# EAGLE design Qwiic_BMP388_Pressure_Sensor (EAGLE 9.6.2)
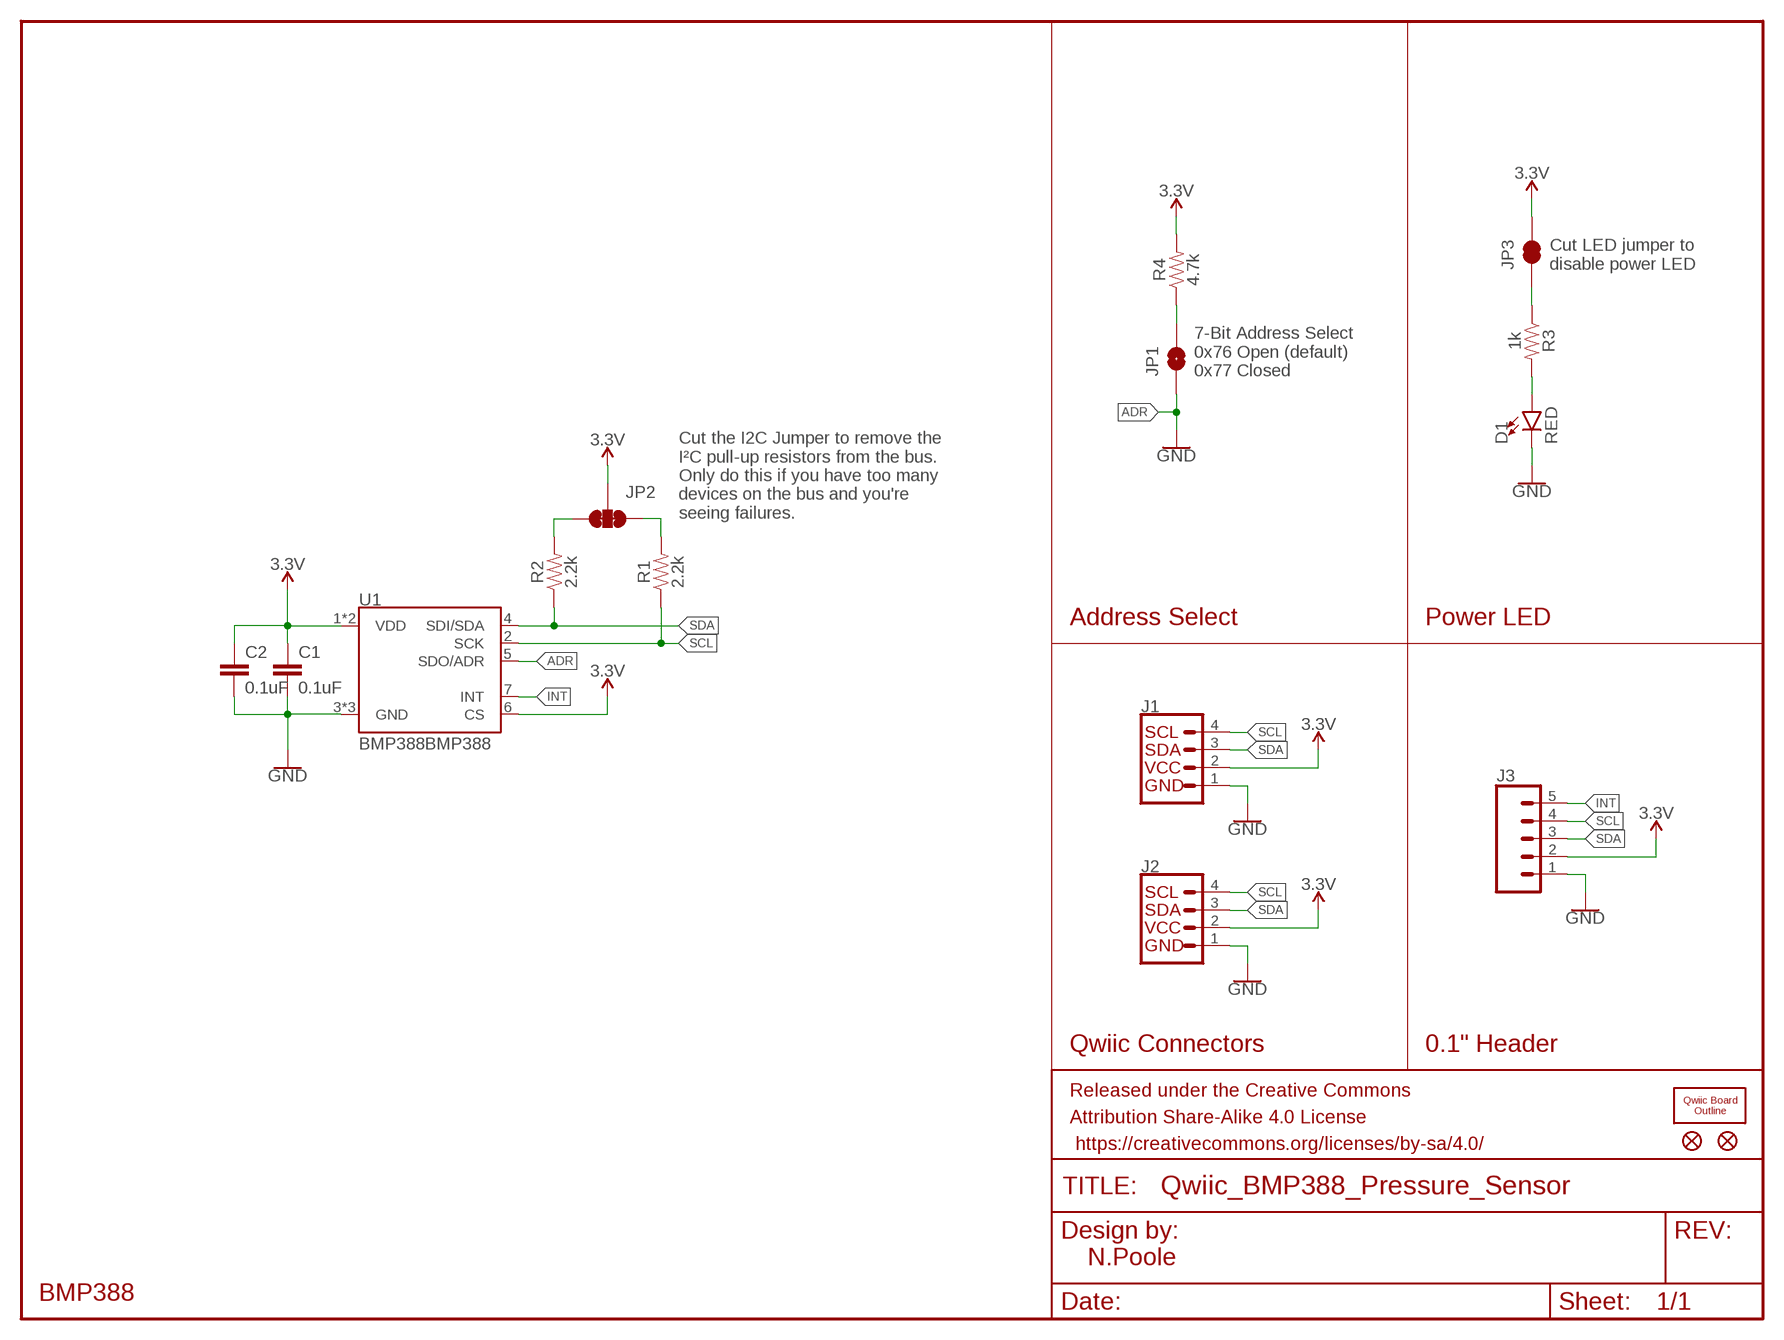
[diagram p0: schematic, sheet 1]

## Parts
A1  QWIIC_BOARD_OUTLINEH  [QWIIC_BOARD_MOUNT_HOLES]
C1  0.1uF  0.1UF-0603-25V-(+80/-20%)  [0603]
C2  0.1uF  0.1UF-0603-25V-(+80/-20%)  [0603]
D1  RED  LED-RED0603  [LED-0603]
FD1  FIDUCIALUFIDUCIAL  [FIDUCIAL-MICRO]
FD2  FIDUCIALUFIDUCIAL  [FIDUCIAL-MICRO]
FRAME1  FRAME-LETTERNO_PACKAGE  [DUMMY]
J1  QWIIC_CONNECTORJS-1MM  [1X04_1MM_RA]
J2  QWIIC_CONNECTORJS-1MM  [1X04_1MM_RA]
J3  CONN_05NO_SILK  [1X05_NO_SILK]
JP1  JUMPER-SMT_2_NO_SILK  [SMT-JUMPER_2_NO_SILK]
JP2  JUMPER-SMT_3_2-NC_TRACE_SILK  [SMT-JUMPER_3_2-NC_TRACE_SILK]
JP3  JUMPER-SMT_2_NC_TRACE_SILK  [SMT-JUMPER_2_NC_TRACE_SILK]
R1  2.2k  2.2KOHM-0603-1/10W-1%  [0603]
R2  2.2k  2.2KOHM-0603-1/10W-1%  [0603]
R3  1k  1KOHM-0603-1/10W-1%  [0603]
R4  4.7k  4.7KOHM-0603-1/10W-1%  [0603]
U1  BMP388BMP388  [LGA-10(2X2)]

## Nets
3.3V: C1.1 C2.1 J1.2(VCC) J2.2(VCC) J3.2 JP2.2 JP3.2 R4.2 U1.1(VDD) U1.6(CS) U1.10(VDD)
ADR: JP1.1 U1.5(SDO/ADR) ; supply symbol labelled GND
GND: C1.2 C2.2 D1.C J1.1(GND) J2.1(GND) J3.1 U1.3(GND) U1.8(GND) U1.9(GND)
INT: J3.5 U1.7(INT)
N$1: JP2.3 R2.2
N$2: JP2.1 R1.2
N$3: JP1.2 R4.1
N$4: JP3.1 R3.1
N$5: D1.A R3.2
SCL: J1.4(SCL) J2.4(SCL) J3.4 R1.1 U1.2(SCK)
SDA: J1.3(SDA) J2.3(SDA) J3.3 R2.1 U1.4(SDI/SDA)

## Notes on the sheet
- Cut LED jumper to 
  disable power LED
- 7-Bit Address Select
  0x76 Open (default)
  0x77 Closed
- Cut the I2C Jumper to remove the 
  I²C pull-up resistors from the bus. 
  Only do this if you have too many
  devices on the bus and you're 
  seeing failures.
- Address Select | Power LED
- Qwiic Connectors | 0.1" Header
- N.Poole
- BMP388

## Library data of the parts
A1 = SparkX:QWIIC_BOARD_OUTLINE: Standard Outline of a Qwiic Board. Good for defining a spot on shields and board areas in which to mount a Qwiic Board.
C1 C2 = SparkFun-Capacitors:0.1UF: 0.1µF ceramic capacitors A capacitor is a passive two-terminal electrical component used to store electrical energy temporarily in an electric field.; PROD_ID: CAP-00810
D1 = SparkFun-LED:LED-RED: Red SMD LED Used in manufacturing of most products at SparkFun Packages: 0603 - SMD 0603 package [Product Link] <http://docs.avagotech.com/docs/AV02-0551EN> 0603 SMART - SMD 0603 SMART package ( more efficient and expensive)[Product Link] <http://www.osram-os.com/Graphics/XPic2/00077099_0.pdf> 1206 - SMD1206 package [Product Link] <https://www.sparkfun.com/datasheets/DevTools/LilyPad/Q150OVS4.pdff> SparkFun Products: Pro Mini 328 -5V <https://www.sparkfun.com/products/821> RedBoard <https://www.sparkfun.com/products/12757> IOIO-OTG <https://www.sparkfun.com/products/13613>; PROD_ID: DIO-00819
FD1 FD2 = SparkFun-Aesthetics:FIDUCIAL: Fiducial Alignment Points Point-of-reference for pick-and-place machines and other optical instruments.
FRAME1 = SparkFun-Aesthetics:FRAME-LETTER: Schematic Frame - Letter Standard 8.5x11 US Letter frame; DESIGNER: Nobody; VERSION: v01
J1 J2 = SparkFun-Connectors:QWIIC_CONNECTOR: SparkFun I2C Standard Qwiic Connector An SMD 1mm pitch JST connector makes it easy and quick (get it? Qwiic?) to connect I2C devices to each other. The Qwiic system <http://www.sparkfun.com/qwiic> enables fast and solderless connection between popular platforms and various sensors and actuators. We carry 200mm <https://www.sparkfun.com/products/14204>, 100mm <https://www.sparkfun.com/products/14205>, 50mm <https://www.sparkfun.com/products/14206>, and breadboard friendly <https://www.sparkfun.com/products/14207> Qwiic cables. We also offer 10 pcs strips <https://www.sparkfun.com/products/14323> the SMD connectors.
J3 = SparkFun-Connectors:CONN_05: Multi connection point. Often used as Generic Header-pin footprint for 0.1 inch spaced/style header connections On any of the 0.1 inch spaced packages, you can populate with these: Break Away Headers - Straight <https://www.sparkfun.com/products/116> (PRT-00116) Break Away Male Headers - Right Angle <https://www.sparkfun.com/products/553> (PRT-00553) Female Headers <https://www.sparkfun.com/products/115> (PRT-00115) Break Away Headers - Machine Pin <https://www.sparkfun.com/products/117> (PRT-00117) Break Away Female Headers - Swiss Machine Pin <https://www.sparkfun.com/products/743> (PRT-00743) For SCREWTERMINALS and SPRING TERMINALS visit here: Screw Terimnals on SparkFun.com <https://www.sparkfun.com/search/results?term=Screw+Terminals> (5mm/3.5mm/2.54mm spacing) This device is also useful as a general connection point to wire up your design to another part of your project. Our various solder wires solder well into these plated through hole pads. Hook-Up Wire - Assortment (Stranded, 22 AWG) <https://www.sparkfun.com/products/11375> (PRT-11375) Hook-Up Wire - Assortment (Solid Core, 22 AWG) <https://www.sparkfun.com/products/11367> (PRT-11367) View the entire wire category on our website here <https://www.sparkfun.com/categories/141> Special notes: Molex polarized connector foot print use with SKU : PRT-08231 with associated crimp pins and housings. 1MM SMD Version SKU: PRT-10208
JP1 = SparkFun-Jumpers:JUMPER-SMT_2_NO: Normally open jumper This jumper has two pads in close proximity to each other. Apply solder to close the connection. Round pads are easier to solder for beginners, but are a lot larger. SparkFun Product that uses the round pads: SparkFun EL Sequencer <https://www.sparkfun.com/products/12781>
JP2 = SparkFun-Jumpers:JUMPER-SMT_3_2-NC_TRACE: Normally closed trace jumper (2 of 2 connections) This jumper has a trace between all three pads so they are normally closed (NC). Use a razor knife to open the connection(s). For best results follow the IPC guidelines for cutting traces: Cutout at least 0.063 mm (0.005 in). Remove all loose material to clean up the cut area. Seal the cut with an approved epoxy. Reapply solder to reclose the connection(s).
JP3 = SparkFun-Jumpers:JUMPER-SMT_2_NC_TRACE: Normally closed trace jumper This jumper has a trace between two pads so it's normally closed (NC). Use a razor knife to open the connection. For best results follow the IPC guidelines for cutting traces: Cutout at least 0.063 mm (0.005 in). Remove all loose material to clean up the cut area. Seal the cut with an approved epoxy. Reapply solder to reclose the connection.
R1 R2 = SparkFun-Resistors:2.2KOHM: 2.2kΩ resistor A resistor is a passive two-terminal electrical component that implements electrical resistance as a circuit element. Resistors act to reduce current flow, and, at the same time, act to lower voltage levels within circuits. - Wikipedia; PROD_ID: RES-08272
R3 = SparkFun-Resistors:1KOHM: 1kΩ resistor A resistor is a passive two-terminal electrical component that implements electrical resistance as a circuit element. Resistors act to reduce current flow, and, at the same time, act to lower voltage levels within circuits. - Wikipedia; PROD_ID: RES-07856
R4 = SparkFun-Resistors:4.7KOHM: 4.7kΩ resistor A resistor is a passive two-terminal electrical component that implements electrical resistance as a circuit element. Resistors act to reduce current flow, and, at the same time, act to lower voltage levels within circuits. - Wikipedia; PROD_ID: RES-07857
U1 = SparkFun-Sensors:BMP388: Bosch BMP3388 Pressure Sensor Senses pressure from 300 hPa to 1250 hPa, sends data out over I2C or Serial; PROD_ID: IC-14045

## Board
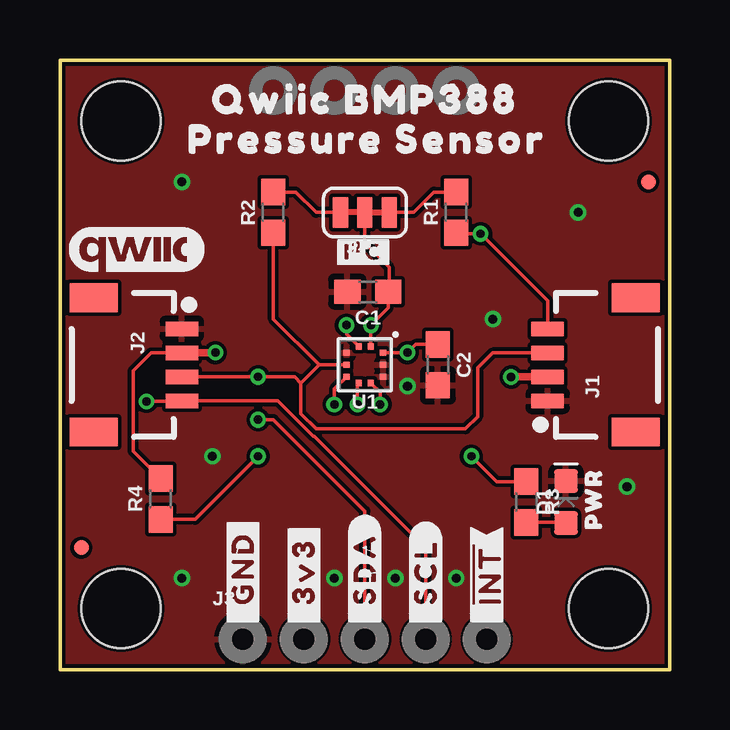
[diagram p1: board, top side]
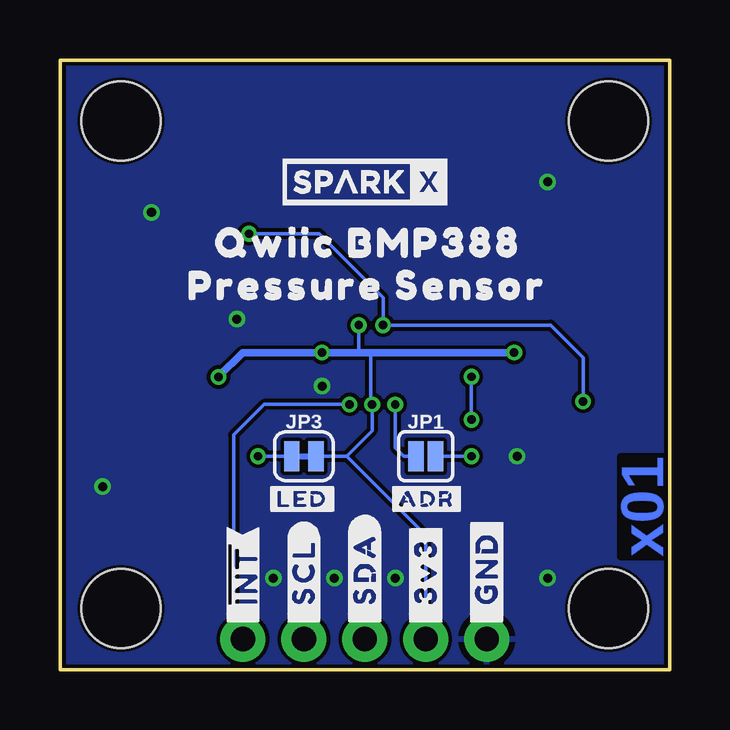
[diagram p2: board, bottom side, seen from below]

Size 25.4 x 25.4 mm. Coordinates in mm from the lower left corner, seen from the top.
Outline: 0,25.4 25.4,25.4 25.4,0 0,0 0,25.4
Copper layers (1*16): Top 0.035mm / dielectric 1.5mm / Bottom 0.035mm
Design rules "SparkFun-2-layer-PCBWay-LIMIT": minimum track width 6mil, minimum drill 0.3mm, track to track 6mil, track to pad 6mil, pad to pad 6mil, via to via 6mil, smd to smd 6mil, copper to edge 6mil, drill to drill 6mil, minimum pad ring 6mil, minimum via ring 6mil, stop-mask expansion 4mil, vias tented up to drill 25mil, thermal gap 10mil

### Footprints (pad centres in the part's own frame; a part is rotated, then mirrored left to right if it is on the bottom)
QWIIC_BOARD_MOUNT_HOLES = hole 3.302: -10.16,10.16; 10.16,10.16; 10.16,-10.16; -10.16,-10.16
0603 = smd 1.1 x 1: 1 -0.85,0; 2 0.85,0
LED-0603 = smd 1 x 1: A -0.877,0; C 0.877,0
FIDUCIAL-MICRO = smd 0.635 x 0.635: 1 0,0
1X04_1MM_RA = smd 0.6 x 1.35: 1 -1.5,0; 2 -0.5,0; 3 0.5,0; 4 1.5,0 | smd 1.2 x 2: NC1 2.8,-3.675; NC2 -2.8,-3.675
1X05_NO_SILK = drill 1.016 pad 1.88: 1 0,0; 2 2.54,0; 3 5.08,0; 4 7.62,0; 5 10.16,0
SMT-JUMPER_2_NO_SILK = smd 0.635 x 1.27: 1 -0.406,0; 2 0.406,0
SMT-JUMPER_3_2-NC_TRACE_SILK = smd 0.635 x 1.27: 1 -1.016,0; 2 0,0; 3 1.016,0
SMT-JUMPER_2_NC_TRACE_SILK = smd 0.635 x 1.27: 1 -0.508,0; 2 0.508,0
LGA-10(2X2) = smd 0.25 x 0.275: 1 0.25,0.762; 2 -0.25,0.762; 6 -0.25,-0.762; 7 0.25,-0.762 | smd 0.275 x 0.25: 3 -0.762,0.5; 4 -0.762,0; 5 -0.762,-0.5; 8 0.762,-0.5; 9 0.762,0; 10 0.762,0.5

### Placement (x,y rotation side)
A1  12.7,12.7 180 top
C1  12.83,15.75 180 top
C2  15.75,12.7 270 top
D1  21.08,6.99 90 top
FD1  24.51,20.32 0 top
FD2  0.89,5.08 0 top
FRAME1  0,0 0 top
J1  20.32,12.7 90 top
J2  5.08,12.7 270 top
J3  7.62,1.27 0 top
JP1  10.16,8.89 0 bottom
JP2  12.7,19.05 180 top
JP3  15.24,8.89 0 bottom
R1  16.51,19.05 90 top
R2  8.89,19.05 90 top
R3  19.43,6.99 270 top
R4  4.19,7.11 90 top
U1  12.7,12.7 0 top
U$1  [#_GND#3889]  7.62,1.65 90 top
U$2  [#_3V3#3890]  10.16,1.65 90 top
U$3  [#_SDA#3891]  12.7,1.65 90 top
U$4  [#_SCL#3892]  15.24,1.65 90 top
U$5  [#_#INT##3893]  17.78,1.65 90 top
U$6  [#I�C#1]  11.3,17.4 0 top
U$7  [#ADR#2]  11.81,7.11 0 bottom
U$8  [#LED#0]  16.89,7.11 0 bottom
U$9  [#_#INT##3893]  17.78,1.65 90 bottom
U$10  [#_SCL#3892]  15.24,1.65 90 bottom
U$11  [#_SDA#3891]  12.7,1.65 90 bottom
U$12  [#_3V3#3890]  10.16,1.65 90 bottom
U$13  [#_GND#3889]  7.62,1.65 90 bottom
U$14  [QWIIC_BMP3888]  5.46,23.75 0 top
U$15  [PRESSURE_SENSOR9]  4.45,22.1 0 top
U$16  [QWIIC_COPYRIGHT_SMALL]  3.17,17.53 0 top
U$17  [QWIIC_BMP3888]  19.81,17.78 0 bottom
U$18  [PRESSURE_SENSOR9]  20.95,16 0 bottom
U$19  [SPARKX-SMALL]  12.7,20.32 0 bottom
U$20  [PWR0]  22.23,5.33 90 top

### Tracks (layer width: path | path; a pad name or v marks a point on that pad's centre or on a via)
3.3V  (via drill 0.35)
  Top 0.152: R4.2 3.05,9.11 3.05,12.45 3.8,13.2 J2.2 | JP2.2 12.7,17.78 13.72,16.76 13.72,15.79 C1.1 13.68,15.07 v12.95,14.35 U1.1 | U1.10 v14.48,13.21 14.82,13.55 C2.1 | U1.6 12.39,11.88 v12.39,11.05
  Top 0.305: J2.2 v6.47,13.2 v6.48,13.21 | v18.8,12.19 v18.8,12.2 J1.2
  Bottom 0.152: J3.2 10.16,5.59 13.46,8.89 | JP3.2 13.46,8.89 | v12.95,14.35 12.95,13.21 | 12.45,13.21 12.45,11.1 v12.39,11.05 12.39,9.96 13.46,8.89
  Bottom 0.305: v6.48,13.21 12.45,13.21 12.95,13.21 v14.48,13.21 17.78,13.21 v18.8,12.19
ADR  (via drill 0.35)
  Top 0.152: U1.5 11.43,11.69 v11.43,11.05
  Bottom 0.152: v11.43,11.05 11.43,9.25 11.07,8.89 JP1.1
GND  (via drill 0.38)
  other vias: 5.08,20.32 21.59,19.05 18.03,14.61 5.08,3.81 11.43,3.81 13.97,3.81 16.51,3.81 23.62,7.62 14.48,11.81 6.35,8.89
  pour Top: 0,25.4 25.4,25.4 25.4,0 0,0
  pour Bottom: 0,25.4 25.4,25.4 25.4,0 0,0
INT  (via drill 0.35)
  Top 0.152: U1.7 13.34,11.55 v13.34,11.05
  Bottom 0.152: v13.34,11.05 16.89,11.05 18.16,9.78 18.16,1.65 J3.5
N$1
  Top 0.152: 8.85,19.94 R2.2 9.82,19.9 10.67,19.05 JP2.3
N$2
  Top 0.152: 16.55,19.94 R1.2 15.58,19.9 14.73,19.05 JP2.1
N$3  (via drill 0.35)
  Top 0.152: v8.26,8.89 5.63,6.26 R4.1
  Bottom 0.152: JP1.2 v8.26,8.89
N$4  (via drill 0.35)
  Top 0.152: R3.1 18.2,7.83 v17.14,8.89
  Bottom 0.152: JP3.1 v17.14,8.89
N$5
  Top 0.152: R3.2 21.05,6.13 D1.A
SCL  (via drill 0.35)
  Top 0.152: U1.2 11.94,13.97 v11.94,14.35 | R1.1 16.55,18.16 v17.53,18.16 20.32,15.37 J1.4 | v3.6,11.18 5.06,11.18 J2.4 9.07,11.2 10.54,9.73 10.59,9.73 15.24,5.08 J3.4
  Bottom 0.152: v17.53,18.16 14.61,18.16 11.94,15.49 v11.94,14.35 4.95,14.35 3.6,13 v3.6,11.18
SDA  (via drill 0.35)
  Top 0.152: U1.4 10.79,12.7 | 10.79,12.7 8.89,14.61 R2.1 | J1.3 18.03,13.2 17.4,12.57 17.4,10.54 16.89,10.03 10.67,10.03 10.03,10.67 10.03,11.94 | 10.03,11.94 10.79,12.7 | J2.3 v8.26,12.2 9.77,12.2 10.03,11.94 | J3.3 12.7,6.6 8.89,10.41 v8.26,10.41
  Bottom 0.152: v8.26,10.41 v8.26,12.2

### Text on the board
Bottom: x01